# EAGLE design Power Distributor (EAGLE 8.3.2)
CNAME: KBOT; CREVISION: 2.0; DESIGNER: Y. LABBE & O. LEVEQUE
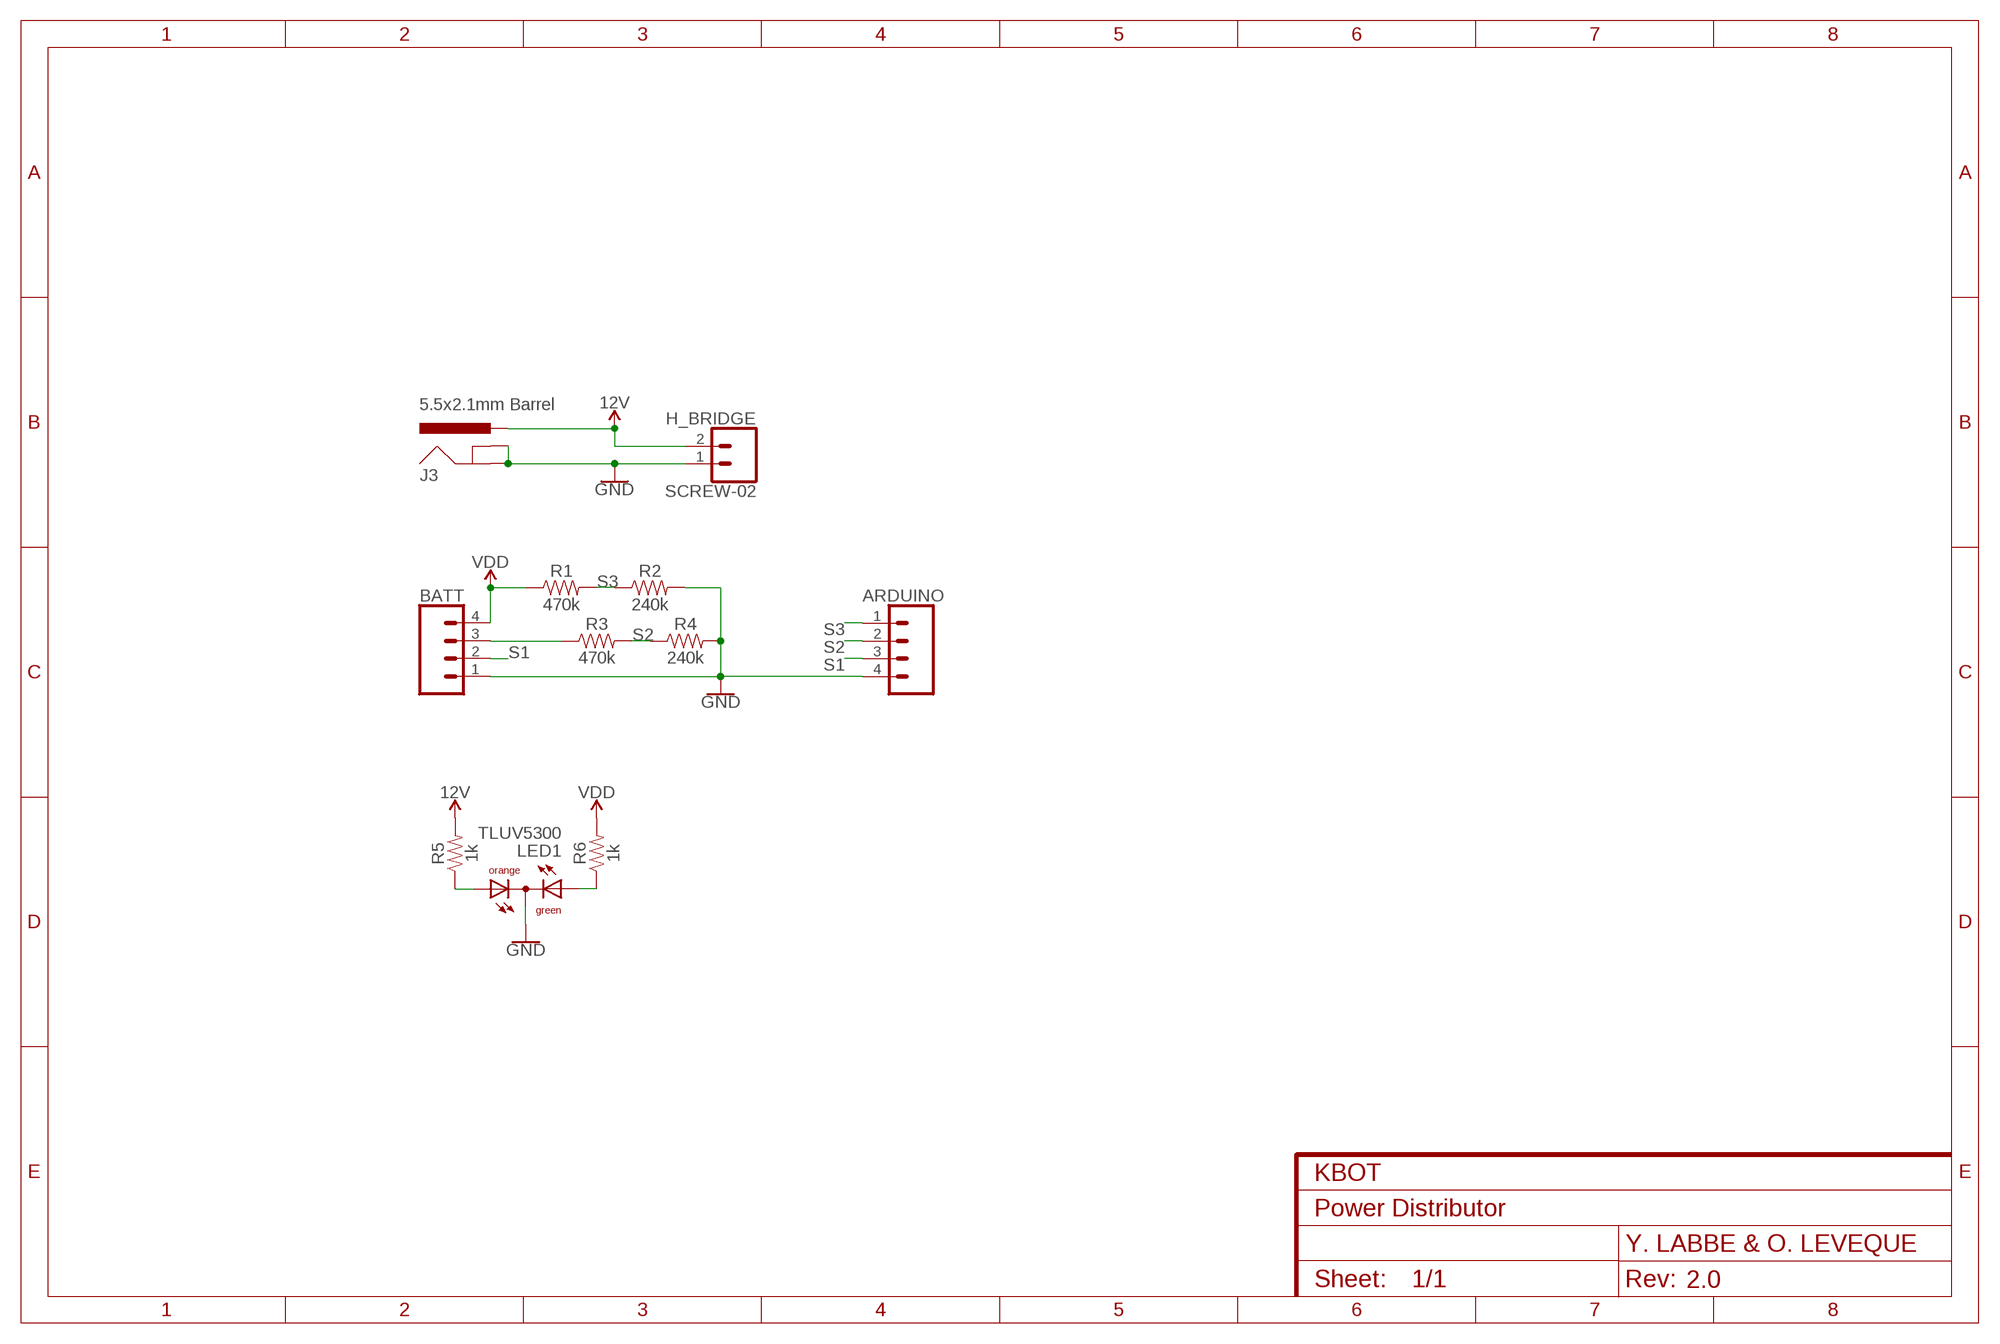
[diagram p0: schematic, sheet 1]

## Parts
ARDUINO  JST-XH-04-PIN-LONG-PAD  [JST-XH-04-PACKAGE-LONG-PAD]
BATT  JST-XH-04-PIN-LONG-PAD  [JST-XH-04-PACKAGE-LONG-PAD]
H_BRIDGE  SCREW-02  [SCREW-02]
J3  5.5x2.1mm Barrel  POWER_JACKSMD  [POWER_JACK_SMD]
LED1  TLUV5300  [TLUV5300]
R1  470k  RESISTOR1206  [1206]
R2  240k  RESISTOR1206  [1206]
R3  470k  RESISTOR1206  [1206]
R4  240k  RESISTOR1206  [1206]
R5  1k  RESISTOR1206  [1206]
R6  1k  RESISTOR1206  [1206]

## Nets
12V: H_BRIDGE.2 J3.VIN0(PWR) R5.2
GND: ARDUINO.4 BATT.1 H_BRIDGE.1 J3.GND(GNDBREAK) J3.P$4(GND) LED1.CC R2.2 R4.2
N$4: BATT.3 R3.1
N$9: LED1.AO R5.1
N$10: LED1.AG R6.1
S1: ARDUINO.3 BATT.2
S2: ARDUINO.2 R3.2 R4.1
S3: ARDUINO.1 R1.2 R2.1
VDD: BATT.4 R1.1 R6.2

## Library data of the parts
ARDUINO BATT = KROBOT:JST-XH-04-PIN: JST XH Connector 2 Pin Wire to board connector. Pitch: 2,54 mm, (0.100") Number of pins: 4 Created by Rembrandt Electronics www.rembrandtelectronics.com
H_BRIDGE = KROBOT:SCREW-02
J3 = SparkFun-Connectors:POWER_JACK: Power Jack Connector This is the standard 5.5mm barrel jack for power. The PTH is the most common, proven, reliable, footprint. The Slot footprint only works if the mill layer is transmitted to the PCB fab house so be warned. Here are the connectors we sell at SparkFun: DC Barrel Power Jack/Connector <https://www.sparkfun.com/products/119> (PRT-00119) DC Barrel Power Jack/Connector (SMD) <https://www.sparkfun.com/products/12748> (PRT-12748) DC Barrel Jack Adapter - Breadboard Compatible <https://www.sparkfun.com/products/10811> (PRT-10811) It is used on this SparkFun product (and many, many others): SparkFun RedBoard - Programmed with Arduino <https://www.sparkfun.com/products/12757> (DEV-12757) Also, if you need a mating power supply or connector, please check these out: Wall Adapter Power Supply - 9VDC 650mA <https://www.sparkfun.com/products/298> (TOL-00298) DC Barrel Jack Adapter - Male <https://www.sparkfun.com/products/10287> (PRT-10287); PROD_ID: CONN-08106; SF_ID: PRT-12748
LED1 = led:TLUV5300: Bicolor LED 5 mm Untinted Diffused Package Source: www.vishay.com .. Bi-Color LED Vashay TLUV5300.pdf
R1-R6 = SparkFun-Resistors:RESISTOR: Generic Resistor Package

## Board
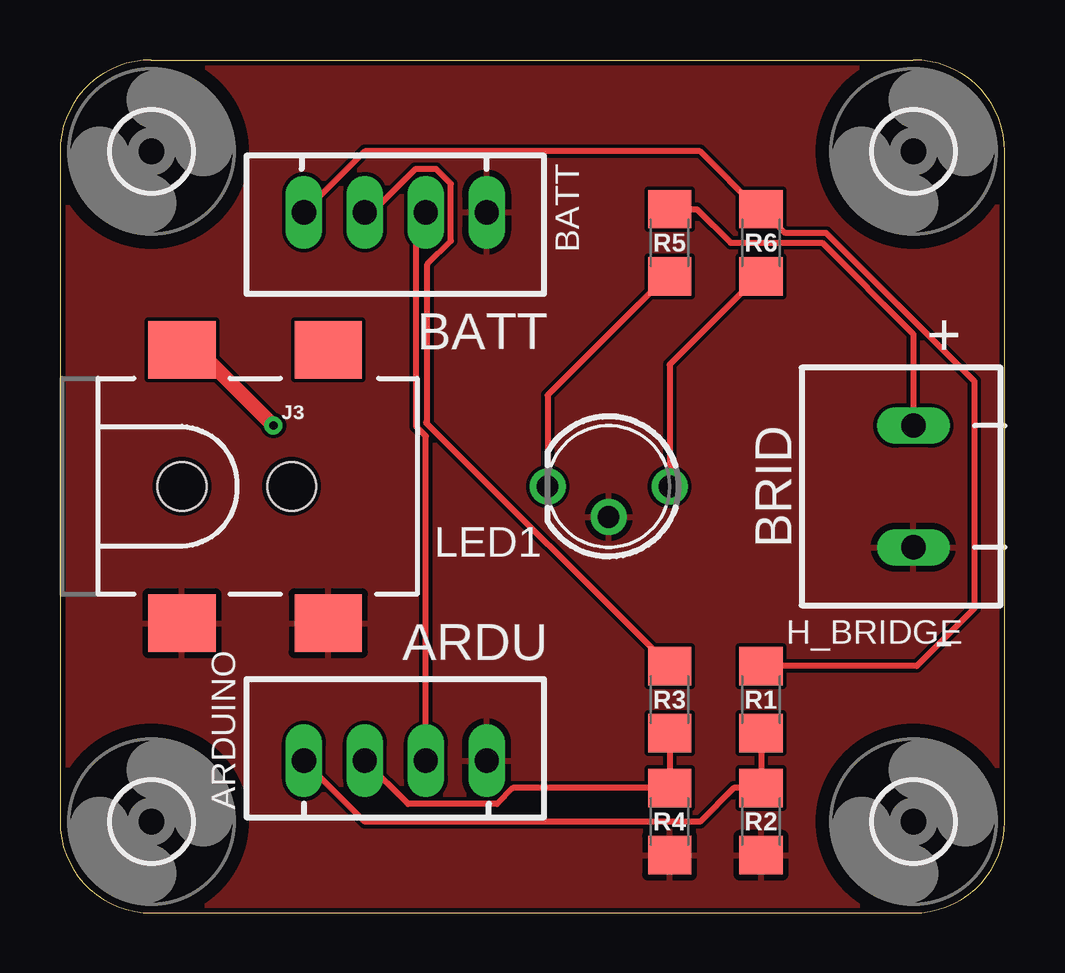
[diagram p1: board, top side]
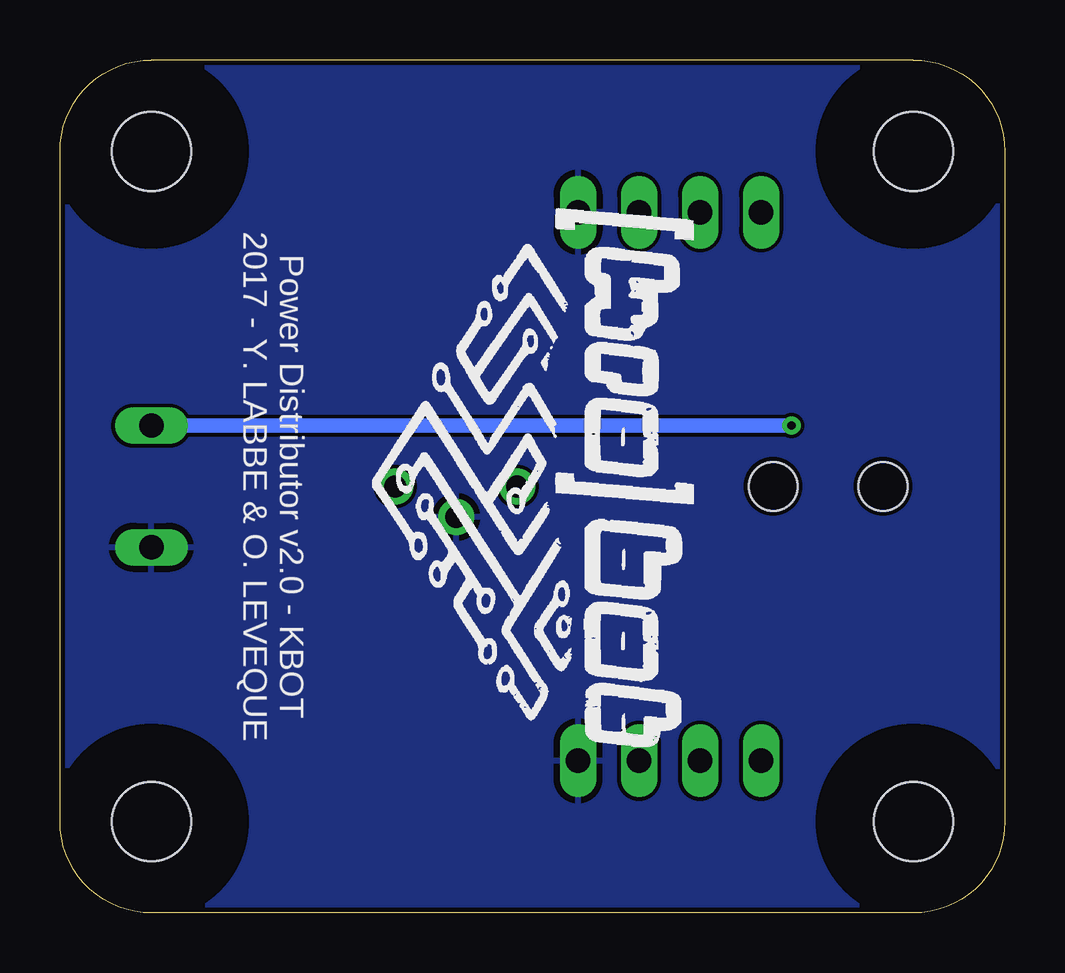
[diagram p2: board, bottom side, seen from below]

Size 39.37 x 35.56 mm. Coordinates in mm from the lower left corner, seen from the top.
Outline: 0,31.75 0,3.81 arc90 3.81,0 35.56,0 arc90 39.37,3.81 39.37,31.75 arc90 35.56,35.56 3.81,35.56 arc90 0,31.75
Copper layers (1*16): Top 0.035mm / dielectric 1.5mm / Bottom 0.035mm
Design rules "default *": minimum track width 6mil, minimum drill 12mil, track to track 6mil, track to pad 6mil, pad to pad 6mil, via to via 6mil, smd to smd 6mil, copper to edge 8mil, drill to drill 6mil, minimum pad ring 10mil, minimum via ring 8mil, stop-mask expansion 4mil, vias tented up to drill 0mil, thermal gap 10mil

### Footprints (pad centres in the part's own frame; a part is rotated, then mirrored left to right if it is on the bottom)
JST-XH-04-PACKAGE-LONG-PAD = drill 1.016 long: 1 0,0; 2 2.54,0; 3 5.08,0; 4 7.62,0
SCREW-02 = drill 1.016 long: 1 0,0; 2 5.08,0
POWER_JACK_SMD = smd 2.8 x 2.4: GND 0,-5.7; P$4 6.1,-5.7; VIN0 0,5.7; VIN1 6.1,5.7 | hole 2.032: 0,0; 4.572,0
TLUV5300 = drill 0.9 pad 1.5: AG 2.54,0; AO -2.54,0; CC 0,-1.27
1206 = smd 1.6 x 1.8: 1 -1.4,0; 2 1.4,0
3,3 = hole 3.3: 0,0

### Placement (x,y rotation side)
ARDUINO  10.16,6.35 0 top
BATT  17.78,29.21 180 top
H_BRIDGE  35.56,15.24 90 top
J3  5.08,17.78 0 top
LED1  22.86,17.78 0 top
R1  29.21,8.89 270 top
R2  29.21,3.81 270 top
R3  25.4,8.89 270 top
R4  25.4,3.81 270 top
R5  25.4,27.94 90 top
R6  29.21,27.94 90 top
U$1  [3,3]  3.81,31.75 0 top
U$2  [3,3]  3.81,3.81 0 top
U$3  [3,3]  35.56,3.81 0 top
U$4  [3,3]  35.56,31.75 0 top
U$5  [LOGO_22MM]  19.05,17.78 270 bottom

### Tracks (layer width: path | path; a pad name or v marks a point on that pad's centre or on a via)
12V  (via drill 0.35)
  Top 0.254: R5.2 26.54,29.34 27.94,27.94 31.75,27.94 35.56,24.13 H_BRIDGE.2
  Top 0.61: v8.89,20.32 5.08,24.13 J3.VIN0
  Bottom 0.61: H_BRIDGE.2 v8.89,20.32
GND
  pour Bottom: 0,35.56 0,0 39.37,0 39.37,35.56
  pour Top: 0,0 0,35.56 39.37,35.56 39.37,0
N$4
  Top 0.254: 15.24,20.45 15.3,20.39 | 15.3,20.39 R3.1 | 15.3,20.39 15.3,27.04 16.28,28.02 16.28,30.4 15.67,31.01 14.81,31.01 13.01,29.21 BATT.3
N$9
  Top 0.254: LED1.AO 20.32,21.59 25.4,26.67 R5.1
N$10
  Top 0.254: LED1.AG 25.4,22.86 29.21,26.67 R6.1
S1
  Top 0.254: ARDUINO.3 15.24,19.88 14.83,20.28 14.83,25.4 | 14.83,25.4 14.83,25.81 | 14.83,25.4 14.83,28.8 BATT.2
S2
  Top 0.254: R3.2 R4.1 18.88,5.21 18.21,4.55 14.5,4.55 ARDUINO.2
S3
  Top 0.254: R1.2 R2.1 28.07,5.21 26.67,3.81 12.7,3.81 ARDUINO.1
VDD
  Top 0.254: R1.1 35.69,10.29 38.1,12.7 38.1,22.16 31.92,28.35 30.2,28.35 R6.2 29.08,29.34 26.67,31.75 12.7,31.75 BATT.4

### Text on the board
tPlace: BATT | + | BRID | ARDU | -
bPlace: Power Distributor v2.0 - KBOT / 2017 - Y. LABBE & O. LEVEQUE